# Altium schematic sheet uc.SchDoc: Controller
size A; Organization: Cal Poly Racing; SheetNumber: 4; SheetTotal: 4; engineer1: Graydon Wilson
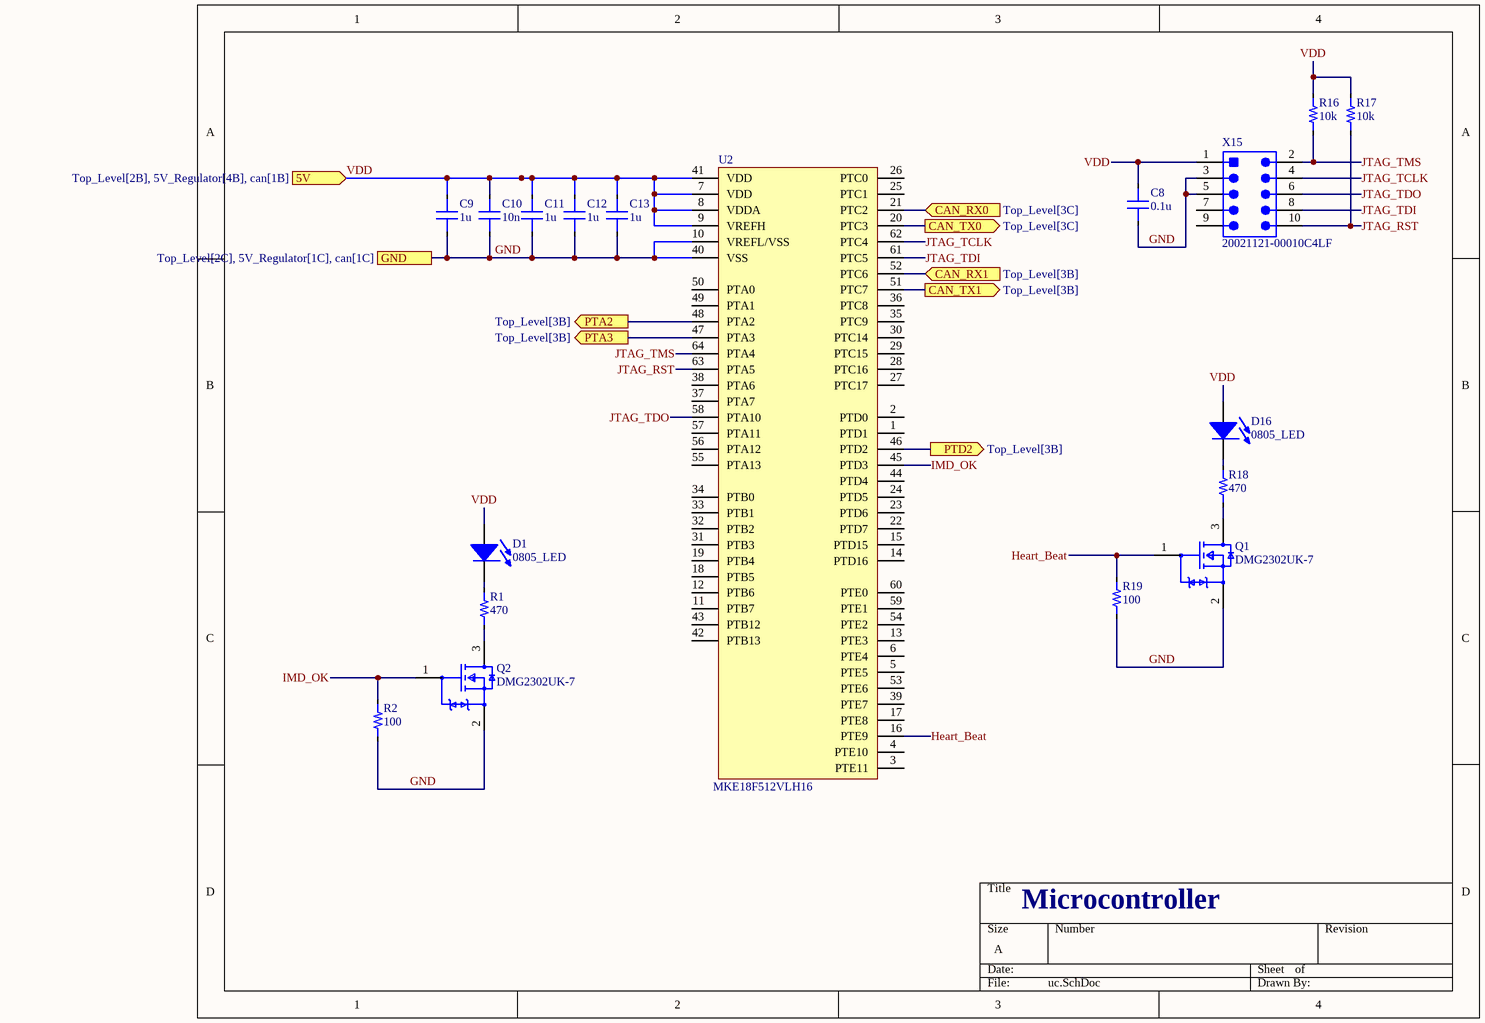
[diagram p0: uc.SchDoc]

## Parts
C8  value 0.1u  [0603_CAP]  (hidden comment: Capacitor)
C9  value 1u  [0603_CAP]  (hidden comment: Capacitor)
C10  value 10n  [0603_CAP]  (hidden comment: Capacitor)
C11  value 1u  [0603_CAP]  (hidden comment: Capacitor)
C12  value 1u  [0603_CAP]  (hidden comment: Capacitor)
C13  value 1u  [0603_CAP]  (hidden comment: Capacitor)
D1  0805_LED  [0805_LED]
D16  0805_LED  [0805_LED]
Q1  DMG2302UK-7  [SOT23-3]
Q2  DMG2302UK-7  [SOT23-3]
R1  value 470  [0603_RES]  (hidden comment: Resistor)
R2  value 100  [0603_RES]  (hidden comment: Resistor)
R16  value 10k  [0603_RES]  (hidden comment: Resistor)
R17  value 10k  [0603_RES]  (hidden comment: Resistor)
R18  value 470  [0603_RES]  (hidden comment: Resistor)
R19  value 100  [0603_RES]  (hidden comment: Resistor)
U2  MKE18F512VLH16  [TQFP64]
X15  20021121-00010C4LF  [HDR2X5_SMT]

## Ports
5V (in, see Top_Level[2B], 5V_Regulator[4B], can[1B]), CAN_RX0 (in, see Top_Level[3C]), CAN_RX1 (in, see Top_Level[3B]), CAN_TX0 (out, see Top_Level[3C]), CAN_TX1 (out, see Top_Level[3B]), GND (see Top_Level[2C], 5V_Regulator[1C], can[1C]), PTA2 (out, see Top_Level[3B]), PTA3 (out, see Top_Level[3B]), PTD2 (out, see Top_Level[3B])

## Nets
CAN_RX0: U2.21(PTC2) ; port CAN_RX0
CAN_RX1: U2.52(PTC6) ; port CAN_RX1
CAN_TX0: U2.20(PTC3) ; port CAN_TX0
CAN_TX1: U2.51(PTC7) ; port CAN_TX1
GND: C8.1 C9.1 C10.1 C11.1 C12.1 C13.1 Q1.2(S) Q2.2(S) R2.1 R19.1 U2.10(VREFL/VSS) U2.40(VSS) X15.3 X15.5 ; port GND
Heart_Beat: Q1.1(G) R19.2 U2.16(PTE9)
IMD_OK: Q2.1(G) R2.2 U2.45(PTD3)
JTAG_RST: R17.1 U2.63(PTA5) X15.10
JTAG_TCLK: U2.62(PTC4) X15.4
JTAG_TDI: U2.61(PTC5) X15.8
JTAG_TDO: U2.58(PTA10) X15.6
JTAG_TMS: R16.1 U2.64(PTA4) X15.2
PTA2: U2.48(PTA2) ; port PTA2
PTA3: U2.47(PTA3) ; port PTA3
PTD2: U2.46(PTD2) ; port PTD2
VDD: C8.2 C9.2 C10.2 C11.2 C12.2 C13.2 D1.1(A) D16.1(A) R16.2 R17.2 U2.7(VDD) U2.8(VDDA) U2.9(VREFH) U2.41(VDD) X15.1 ; port 5V
NetD1_2: D1.2(K) R1.2
NetD16_2: D16.2(K) R18.2
NetQ1_3: Q1.3(D) R18.1
NetQ2_3: Q2.3(D) R1.1

Not connected (* = marked no-connect by the designer): U2 1(PTD1) 2(PTD0) 3(PTE11) 4(PTE10) 5(PTE5) 6(PTE4) 11(PTB7) 12(PTB6) 13(PTE3) 14(PTD16) 15(PTD15) 17(PTE8) 18(PTB5) 19(PTB4) 22(PTD7) 23(PTD6) 24(PTD5) 25(PTC1) 26(PTC0) 27(PTC17) 28(PTC16) 29(PTC15) 30(PTC14) 31(PTB3) 32(PTB2) 33(PTB1) 34(PTB0) 35(PTC9) 36(PTC8) 37(PTA7) 38(PTA6) 39(PTE7) 42(PTB13) 43(PTB12) 44(PTD4) 49(PTA1) 50(PTA0) 53(PTE6) 54(PTE2) 55(PTA13) 56(PTA12) 57(PTA11) 59(PTE1) 60(PTE0); X15 7 9

## Notes on the sheet
- Microcontroller
- Title
- Size:
- Date:
- A
- Number:
- Time:
- Revision:
- Sheet
- of
- File:

## Library data of the parts
D1 D16 = 0805_LED: Generic 0805 LED
Q1 Q2 = DMG2302UK-7: MOSFET N-CH 20V 2.8A SOT23; Manufacturer: Diodes Inc.; Reverse Recovery Time: 5.3ns; Gate Charge At Vgs: 2.8nC @ 10V; Turn On Delay Time: 0.6ns; Pulse Drain Current: 12A; Max Forward Diode Voltage: 1.2V; Reverse Recovery Charge: 0.5nC; Automotive Grade: Grade 0; Threshold Vgs Min: 0.3V; Number Of N Channels: 1; Standoff Height: 0.013mm; Typ Forward Diode Voltage: 0.7V; Drain To Source Resistance: 61mΩ; Rthja Max: 192°C/W; Max Junction Temp: +150°C; Input Capacitace At Vds: 130pF @ 10V; Threshold Vgs Max: 1V; Turn Off Delay Time: 4.2ns; Depletion Mode: False; Gate To Source Voltage: 12V; Power Dissipation: 0.66W; Device Class L1: Discrete Semiconductors; Footprint Url: https://www.diodes.com/assets/Package-Files/SOT23.pdf; Lead Free: Yes; Manufacturer Part Number: DMG2302UK-7; Temperature Range High: +150°C; Drain To Source Voltage: 20V; Category: Trans; Digikey Description: MOSFET N-CH 20V 2.8A SOT23; RoHS: TRUE; Device Class L2: Transistors; Height: 1.1mm; Automotive: Yes; Package: SOT23; Drain To Source Breakdown Voltage: 20V; Continuous Drain Current: 2.8A; ComponentLink2Description: Datasheet; Device Class L3: MOSFETs; Octopart: https://octopart.com/dmg2302uk-7-diodes+inc.-73850182; Temperature Range Low: -55°C; Temperature: -55°C to +150°C; Number Of Channels: 1; ComponentLink2URL: https://www.diodes.com/assets/Datasheets/DMG2302UK.pdf
U2 = MKE18F512VLH16: Vcc: 2.7-5.5; Package: TQFP64
X15 = 20021121-00010C4LF: Header, 10-Leads, Body 3.43x6.35mm, Pitch 1.27mm; Circuits: 10; Name: 20021121-00010C4LF; ComponentLink1Description: Digikey; ComponentLink1URL: https://www.digikey.com/product-detail/en/amphenol-icc-fci/20021121-00010C4LF/609-3695-1-ND/2209147
C8-C13 = Capacitor: Dielectric: *; Percent Tolerance: *; ESR: *
R1 R2 R16-R19 = Resistor: Tolerance: *